# Altium project FPGA.PrjPcb
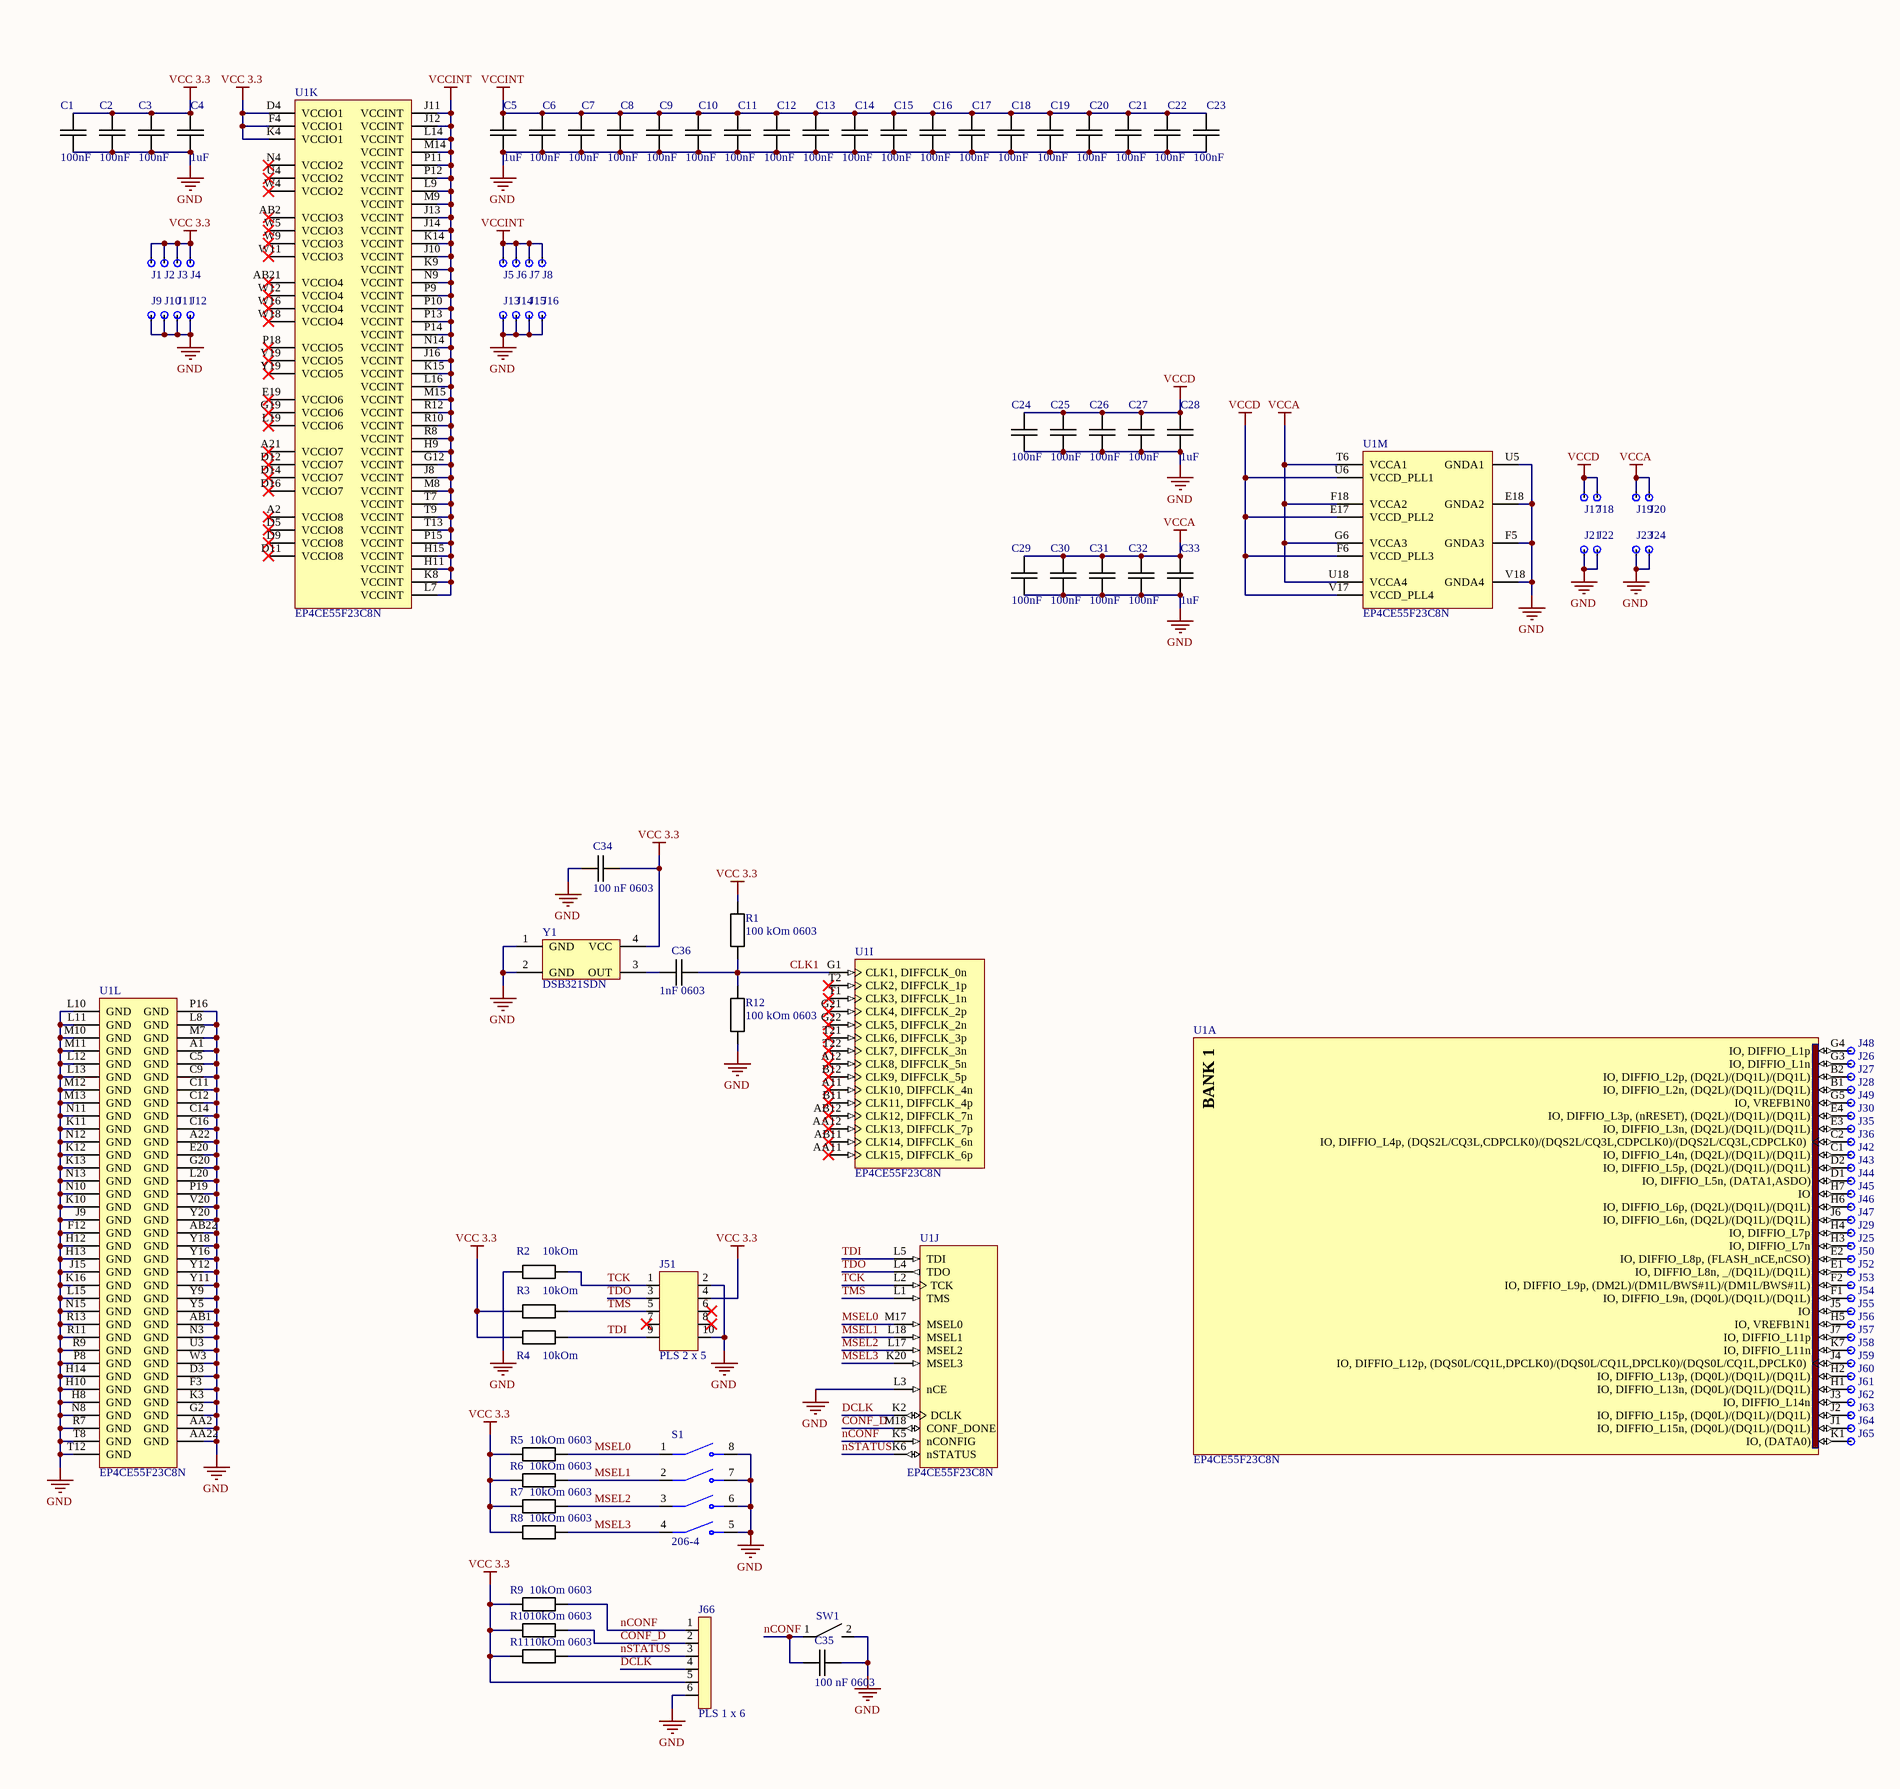
[diagram p0: Sheet1.SchDoc, left]
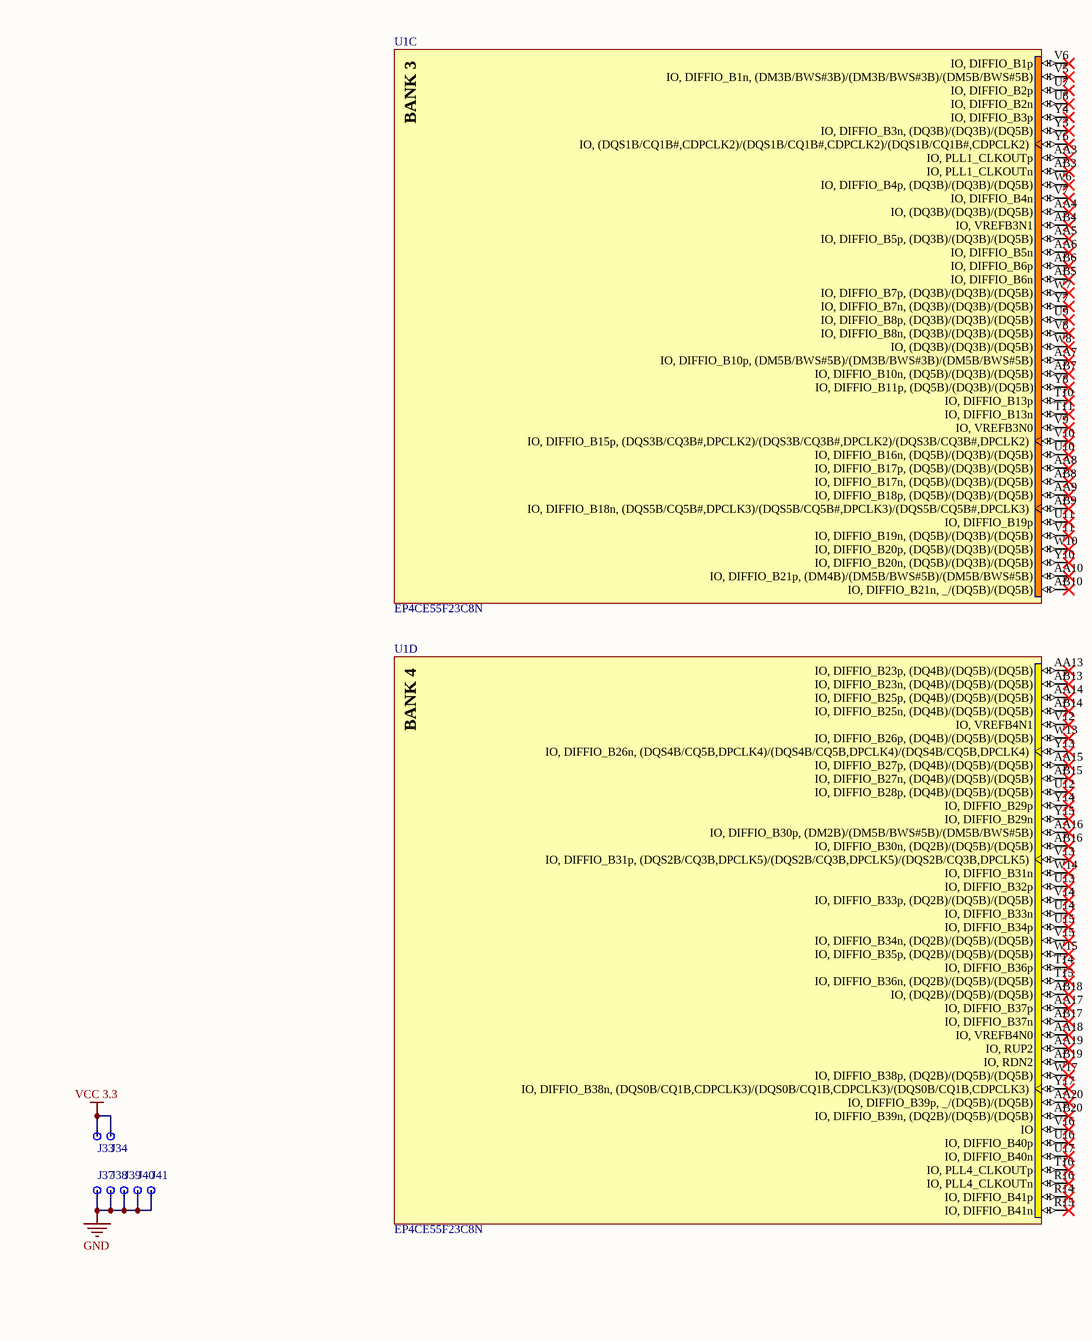
[diagram p1: Sheet1.SchDoc, middle]
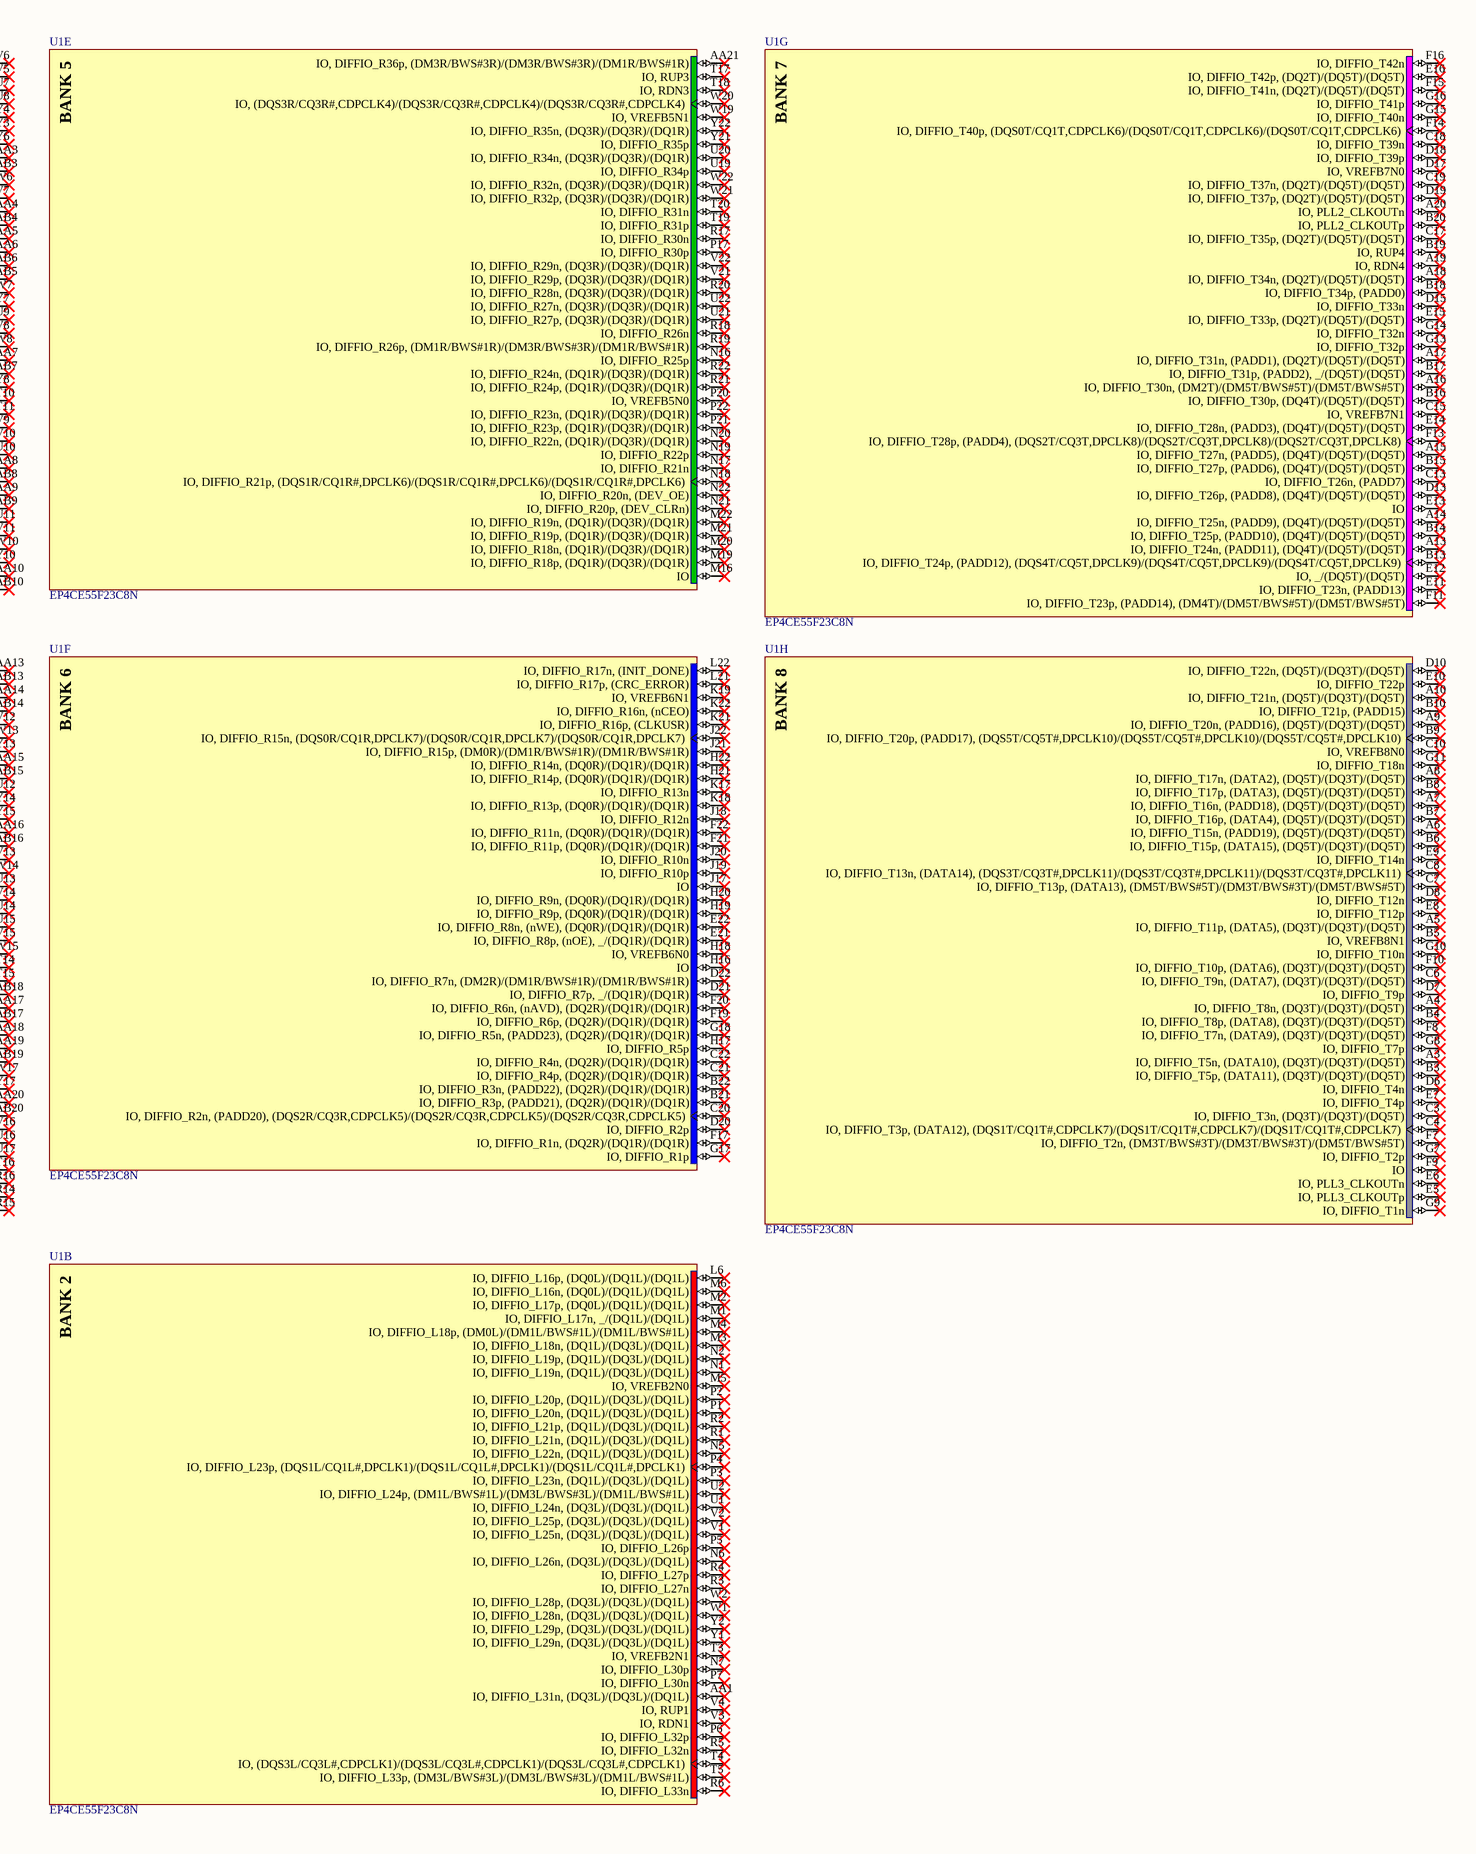
[diagram p2: Sheet1.SchDoc, right]
1 sheet, 116 parts. Net scope: global (net labels, ports and power ports of the same name join across sheets).
Board file: PCB_Main.PcbDoc

## Sheet Sheet1.SchDoc
size 889 x 381 mm; SheetNumber: 1; SheetTotal: 1

### Parts
C1  100nF  [CAPC1608X90]
C2  100nF  [CAPC1608X90]
C3  100nF  [CAPC1608X90]
C4  1uF  [CAPC1608X90]
C5  1uF  [CAPC1608X90]
C6  100nF  [CAPC1608X90]
C7  100nF  [CAPC1608X90]
C8  100nF  [CAPC1608X90]
C9  100nF  [CAPC1608X90]
C10  100nF  [CAPC1608X90]
C11  100nF  [CAPC1608X90]
C12  100nF  [CAPC1608X90]
C13  100nF  [CAPC1608X90]
C14  100nF  [CAPC1608X90]
C15  100nF  [CAPC1608X90]
C16  100nF  [CAPC1608X90]
C17  100nF  [CAPC1608X90]
C18  100nF  [CAPC1608X90]
C19  100nF  [CAPC1608X90]
C20  100nF  [CAPC1608X90]
C21  100nF  [CAPC1608X90]
C22  100nF  [CAPC1608X90]
C23  100nF  [CAPC1608X90]
C24  100nF  [CAPC1608X90]
C25  100nF  [CAPC1608X90]
C26  100nF  [CAPC1608X90]
C27  100nF  [CAPC1608X90]
C28  1uF  [CAPC1608X90]
C29  100nF  [CAPC1608X90]
C30  100nF  [CAPC1608X90]
C31  100nF  [CAPC1608X90]
C32  100nF  [CAPC1608X90]
C33  1uF  [CAPC1608X90]
C34  100 nF 0603  [CAPC1608X90]
C35  100 nF 0603  [CAPC1608X90]
C36  1nF 0603  [CAPC1608X90]
J1  Pin1  [Pin1]  (value not drawn)
J2  Pin1  [Pin1]  (value not drawn)
J3  Pin1  [Pin1]  (value not drawn)
J4  Pin1  [Pin1]  (value not drawn)
J5  Pin1  [Pin1]  (value not drawn)
J6  Pin1  [Pin1]  (value not drawn)
J7  Pin1  [Pin1]  (value not drawn)
J8  Pin1  [Pin1]  (value not drawn)
J9  Pin1  [Pin1]  (value not drawn)
J10  Pin1  [Pin1]  (value not drawn)
J11  Pin1  [Pin1]  (value not drawn)
J12  Pin1  [Pin1]  (value not drawn)
J13  Pin1  [Pin1]  (value not drawn)
J14  Pin1  [Pin1]  (value not drawn)
J15  Pin1  [Pin1]  (value not drawn)
J16  Pin1  [Pin1]  (value not drawn)
J17  Pin1  [Pin1]  (value not drawn)
J18  Pin1  [Pin1]  (value not drawn)
J19  Pin1  [Pin1]  (value not drawn)
J20  Pin1  [Pin1]  (value not drawn)
J21  Pin1  [Pin1]  (value not drawn)
J22  Pin1  [Pin1]  (value not drawn)
J23  Pin1  [Pin1]  (value not drawn)
J24  Pin1  [Pin1]  (value not drawn)
J25  Pin1  [Pin1]  (value not drawn)
J26  Pin1  [Pin1]  (value not drawn)
J27  Pin1  [Pin1]  (value not drawn)
J28  Pin1  [Pin1]  (value not drawn)
J29  Pin1  [Pin1]  (value not drawn)
J30  Pin1  [Pin1]  (value not drawn)
J33  Pin1  [Pin1]  (value not drawn)
J34  Pin1  [Pin1]  (value not drawn)
J35  Pin1  [Pin1]  (value not drawn)
J36  Pin1  [Pin1]  (value not drawn)
J37  Pin1  [Pin1]  (value not drawn)
J38  Pin1  [Pin1]  (value not drawn)
J39  Pin1  [Pin1]  (value not drawn)
J40  Pin1  [Pin1]  (value not drawn)
J41  Pin1  [Pin1]  (value not drawn)
J42  Pin1  [Pin1]  (value not drawn)
J43  Pin1  [Pin1]  (value not drawn)
J44  Pin1  [Pin1]  (value not drawn)
J45  Pin1  [Pin1]  (value not drawn)
J46  Pin1  [Pin1]  (value not drawn)
J47  Pin1  [Pin1]  (value not drawn)
J48  Pin1  [Pin1]  (value not drawn)
J49  Pin1  [Pin1]  (value not drawn)
J50  Pin1  [Pin1]  (value not drawn)
J51  PLS 2 x 5  [PLS 2x5 2.54]
J52  Pin1  [Pin1]  (value not drawn)
J53  Pin1  [Pin1]  (value not drawn)
J54  Pin1  [Pin1]  (value not drawn)
J55  Pin1  [Pin1]  (value not drawn)
J56  Pin1  [Pin1]  (value not drawn)
J57  Pin1  [Pin1]  (value not drawn)
J58  Pin1  [Pin1]  (value not drawn)
J59  Pin1  [Pin1]  (value not drawn)
J60  Pin1  [Pin1]  (value not drawn)
J61  Pin1  [Pin1]  (value not drawn)
J62  Pin1  [Pin1]  (value not drawn)
J63  Pin1  [Pin1]  (value not drawn)
J64  Pin1  [Pin1]  (value not drawn)
J65  Pin1  [Pin1]  (value not drawn)
J66  PLS 1 x 6  [PLS 1x6 2.54]
R1  100 kOm 0603  [RES 0603]
R2  10kOm  [RES 0603]
R3  10kOm  [RES 0603]
R4  10kOm  [RES 0603]
R5  10kOm 0603  [RES 0603]
R6  10kOm 0603  [RES 0603]
R7  10kOm 0603  [RES 0603]
R8  10kOm 0603  [RES 0603]
R9  10kOm 0603  [RES 0603]
R10  10kOm 0603  [RES 0603]
R11  10kOm 0603  [RES 0603]
R12  100 kOm 0603  [RES 0603]
S1  206-4  [SW_206-4]
SW1  (no value)  [SW_5-1437565-0]
U1  EP4CE55F23C8N  [FBGA484_A-240]  (parts A,B,C,D,E,F,G,H,I,J,K,L,M of 13)
Y1  DSB321SDN  [DSB321SDN]

### Nets
GND: C1.1 C2.1 C3.1 C4.1 C5.1 C6.1 C7.1 C8.1 C9.1 C10.1 C11.1 C12.1 C13.1 C14.1 C15.1 C16.1 C17.1 C18.1 C19.1 C20.1 C21.1 C22.1 C23.1 C24.1 C25.1 C26.1 C27.1 C28.1 C29.1 C30.1 C31.1 C32.1 C33.1 C34.1 C35.2 J9.1 J10.1 J11.1 J12.1 J13.1 J14.1 J15.1 J16.1 J21.1 J22.1 J23.1 J24.1 J37.1 J38.1 J39.1 J40.1 J41.1 J51.2 J51.10 J66.6 R2.1 R12.2 S1.5(NO4) S1.6(NO3) S1.7(NO2) S1.8(NO1) SW1.2 U1.A1(GND) U1.A22(GND) U1.AA2(GND) U1.AA22(GND) U1.AB1(GND) U1.AB22(GND) U1.C5(GND) U1.C9(GND) U1.C11(GND) U1.C12(GND) U1.C14(GND) U1.C16(GND) U1.D3(GND) U1.E18(GNDA2) U1.E20(GND) U1.F3(GND) U1.F5(GNDA3) U1.F12(GND) U1.G2(GND) U1.G20(GND) U1.H8(GND) U1.H10(GND) U1.H12(GND) U1.H13(GND) U1.H14(GND) U1.J9(GND) U1.J15(GND) U1.K3(GND) U1.K10(GND) U1.K11(GND) U1.K12(GND) U1.K13(GND) U1.K16(GND) U1.L3(nCE) U1.L8(GND) U1.L10(GND) U1.L11(GND) U1.L12(GND) U1.L13(GND) U1.L15(GND) U1.L20(GND) U1.M7(GND) U1.M10(GND) U1.M11(GND) U1.M12(GND) U1.M13(GND) U1.N3(GND) U1.N8(GND) U1.N10(GND) U1.N11(GND) U1.N12(GND) U1.N13(GND) U1.N15(GND) U1.P8(GND) U1.P16(GND) U1.P19(GND) U1.R7(GND) U1.R9(GND) U1.R11(GND) U1.R13(GND) U1.T8(GND) U1.T12(GND) U1.U3(GND) U1.U5(GNDA1) U1.V18(GNDA4) U1.V20(GND) U1.W3(GND) U1.Y5(GND) U1.Y9(GND) U1.Y11(GND) U1.Y12(GND) U1.Y16(GND) U1.Y18(GND) U1.Y20(GND) Y1.1(GND) Y1.2(GND)
VCC 3.3: C1.2 C2.2 C3.2 C4.2 C34.2 J1.1 J2.1 J3.1 J4.1 J33.1 J34.1 J51.4 J66.5 R1.2 R3.2 R4.2 R5.2 R6.2 R7.2 R8.2 R9.2 R10.2 R11.2 U1.D4(VCCIO1) U1.F4(VCCIO1) U1.K4(VCCIO1) Y1.4(VCC)
VCCA: C29.2 C30.2 C31.2 C32.2 C33.2 J19.1 J20.1 U1.F18(VCCA2) U1.G6(VCCA3) U1.T6(VCCA1) U1.U18(VCCA4)
VCCD: C24.2 C25.2 C26.2 C27.2 C28.2 J17.1 J18.1 U1.E17(VCCD_PLL2) U1.F6(VCCD_PLL3) U1.U6(VCCD_PLL1) U1.V17(VCCD_PLL4)
VCCINT: C5.2 C6.2 C7.2 C8.2 C9.2 C10.2 C11.2 C12.2 C13.2 C14.2 C15.2 C16.2 C17.2 C18.2 C19.2 C20.2 C21.2 C22.2 C23.2 J5.1 J6.1 J7.1 J8.1 U1.G12(VCCINT) U1.H9(VCCINT) U1.H11(VCCINT) U1.H15(VCCINT) U1.J8(VCCINT) U1.J10(VCCINT) U1.J11(VCCINT) U1.J12(VCCINT) U1.J13(VCCINT) U1.J14(VCCINT) U1.J16(VCCINT) U1.K8(VCCINT) U1.K9(VCCINT) U1.K14(VCCINT) U1.K15(VCCINT) U1.L7(VCCINT) U1.L9(VCCINT) U1.L14(VCCINT) U1.L16(VCCINT) U1.M8(VCCINT) U1.M9(VCCINT) U1.M14(VCCINT) U1.M15(VCCINT) U1.N9(VCCINT) U1.N14(VCCINT) U1.P9(VCCINT) U1.P10(VCCINT) U1.P11(VCCINT) U1.P12(VCCINT) U1.P13(VCCINT) U1.P14(VCCINT) U1.P15(VCCINT) U1.R8(VCCINT) U1.R10(VCCINT) U1.R12(VCCINT) U1.T7(VCCINT) U1.T9(VCCINT) U1.T13(VCCINT)
CLK1: C36.2 R1.1 R12.1 U1.G1(CLK1,_DIFFCLK_0n)
CONF_D: J66.2 R10.1 U1.M18(CONF_DONE)
DCLK: J66.4 U1.K2(DCLK)
MSEL0: R5.1 S1.1(COM1) U1.M17(MSEL0)
MSEL1: R6.1 S1.2(COM2) U1.L18(MSEL1)
MSEL2: R7.1 S1.3(COM3) U1.L17(MSEL2)
MSEL3: R8.1 S1.4(COM4) U1.K20(MSEL3)
nCONF: C35.1 J66.1 R9.1 SW1.1 U1.K5(nCONFIG)
nSTATUS: J66.3 R11.1 U1.K6(nSTATUS)
TCK: J51.1 R2.2 U1.L2(TCK)
TDI: J51.9 R4.1 U1.L5(TDI)
TDO: J51.3 U1.L4(TDO)
TMS: J51.5 R3.1 U1.L1(TMS)
NetC36_1: C36.1 Y1.3(OUT)
NetJ25_1: J25.1 U1.H3(IO,_DIFFIO_L7n)
NetJ26_1: J26.1 U1.G3(IO,_DIFFIO_L1n)
NetJ27_1: J27.1 U1.B2(IO,_DIFFIO_L2p,_(DQ2L)/(DQ1L)/(DQ1L))
NetJ28_1: J28.1 U1.B1(IO,_DIFFIO_L2n,_(DQ2L)/(DQ1L)/(DQ1L))
NetJ29_1: J29.1 U1.H4(IO,_DIFFIO_L7p)
NetJ30_1: J30.1 U1.E4(IO,_DIFFIO_L3p,_(nRESET),_(DQ2L)/(DQ1L)/(DQ1L))
NetJ35_1: J35.1 U1.E3(IO,_DIFFIO_L3n,_(DQ2L)/(DQ1L)/(DQ1L))
NetJ36_1: J36.1 U1.C2(IO,_DIFFIO_L4p,_(DQS2L/CQ3L,CDPCLK0)/(DQS2L/CQ3L,CDPCLK0)/(DQS2L/CQ3L,CDPCLK0))
NetJ42_1: J42.1 U1.C1(IO,_DIFFIO_L4n,_(DQ2L)/(DQ1L)/(DQ1L))
NetJ43_1: J43.1 U1.D2(IO,_DIFFIO_L5p,_(DQ2L)/(DQ1L)/(DQ1L))
NetJ44_1: J44.1 U1.D1(IO,_DIFFIO_L5n,_(DATA1,ASDO))
NetJ45_1: J45.1 U1.H7(IO)
NetJ46_1: J46.1 U1.H6(IO,_DIFFIO_L6p,_(DQ2L)/(DQ1L)/(DQ1L))
NetJ47_1: J47.1 U1.J6(IO,_DIFFIO_L6n,_(DQ2L)/(DQ1L)/(DQ1L))
NetJ48_1: J48.1 U1.G4(IO,_DIFFIO_L1p)
NetJ49_1: J49.1 U1.G5(IO,_VREFB1N0)
NetJ50_1: J50.1 U1.E2(IO,_DIFFIO_L8p,_(FLASH_nCE,nCSO))
NetJ52_1: J52.1 U1.E1(IO,_DIFFIO_L8n,__/(DQ1L)/(DQ1L))
NetJ53_1: J53.1 U1.F2(IO,_DIFFIO_L9p,_(DM2L)/(DM1L/BWS#1L)/(DM1L/BWS#1L))
NetJ54_1: J54.1 U1.F1(IO,_DIFFIO_L9n,_(DQ0L)/(DQ1L)/(DQ1L))
NetJ55_1: J55.1 U1.J5(IO)
NetJ56_1: J56.1 U1.H5(IO,_VREFB1N1)
NetJ57_1: J57.1 U1.J7(IO,_DIFFIO_L11p)
NetJ58_1: J58.1 U1.K7(IO,_DIFFIO_L11n)
NetJ59_1: J59.1 U1.J4(IO,_DIFFIO_L12p,_(DQS0L/CQ1L,DPCLK0)/(DQS0L/CQ1L,DPCLK0)/(DQS0L/CQ1L,DPCLK0))
NetJ60_1: J60.1 U1.H2(IO,_DIFFIO_L13p,_(DQ0L)/(DQ1L)/(DQ1L))
NetJ61_1: J61.1 U1.H1(IO,_DIFFIO_L13n,_(DQ0L)/(DQ1L)/(DQ1L))
NetJ62_1: J62.1 U1.J3(IO,_DIFFIO_L14n)
NetJ63_1: J63.1 U1.J2(IO,_DIFFIO_L15p,_(DQ0L)/(DQ1L)/(DQ1L))
NetJ64_1: J64.1 U1.J1(IO,_DIFFIO_L15n,_(DQ0L)/(DQ1L)/(DQ1L))
NetJ65_1: J65.1 U1.K1(IO,_(DATA0))

Not connected (* = marked no-connect by the designer): J51 6* 7* 8*; U1 A2(VCCIO8)* A3(IO,_DIFFIO_T5n,_(DATA10),_(DQ3T)/(DQ3T)/(DQ5T))* A4(IO,_DIFFIO_T8n,_(DQ3T)/(DQ3T)/(DQ5T))* A5(IO,_DIFFIO_T11p,_(DATA5),_(DQ3T)/(DQ3T)/(DQ5T))* A6(IO,_DIFFIO_T15n,_(PADD19),_(DQ5T)/(DQ3T)/(DQ5T))* A7(IO,_DIFFIO_T16n,_(PADD18),_(DQ5T)/(DQ3T)/(DQ5T))* A8(IO,_DIFFIO_T17n,_(DATA2),_(DQ5T)/(DQ3T)/(DQ5T))* A9(IO,_DIFFIO_T20n,_(PADD16),_(DQ5T)/(DQ3T)/(DQ5T))* A10(IO,_DIFFIO_T21n,_(DQ5T)/(DQ3T)/(DQ5T))* A11(CLK10,_DIFFCLK_4n)* A12(CLK8,_DIFFCLK_5n)* A13(IO,_DIFFIO_T24n,_(PADD11),_(DQ4T)/(DQ5T)/(DQ5T))* A14(IO,_DIFFIO_T25n,_(PADD9),_(DQ4T)/(DQ5T)/(DQ5T))* A15(IO,_DIFFIO_T27n,_(PADD5),_(DQ4T)/(DQ5T)/(DQ5T))* A16(IO,_DIFFIO_T30n,_(DM2T)/(DM5T/BWS#5T)/(DM5T/BWS#5T))* A17(IO,_DIFFIO_T31n,_(PADD1),_(DQ2T)/(DQ5T)/(DQ5T))* A18(IO,_DIFFIO_T34n,_(DQ2T)/(DQ5T)/(DQ5T))* A19(IO,_RDN4)* A20(IO,_PLL2_CLKOUTn)* A21(VCCIO7)* AA1(IO,_DIFFIO_L31n,_(DQ3L)/(DQ3L)/(DQ1L))* AA3(IO,_PLL1_CLKOUTp)* AA4(IO,_(DQ3B)/(DQ3B)/(DQ5B))* AA5(IO,_DIFFIO_B5p,_(DQ3B)/(DQ3B)/(DQ5B))* AA6(IO,_DIFFIO_B5n)* AA7(IO,_DIFFIO_B10p,_(DM5B/BWS#5B)/(DM3B/BWS#3B)/(DM5B/BWS#5B))* AA8(IO,_DIFFIO_B17p,_(DQ5B)/(DQ3B)/(DQ5B))* AA9(IO,_DIFFIO_B18p,_(DQ5B)/(DQ3B)/(DQ5B))* AA10(IO,_DIFFIO_B21p,_(DM4B)/(DM5B/BWS#5B)/(DM5B/BWS#5B))* AA11(CLK15,_DIFFCLK_6p)* AA12(CLK13,_DIFFCLK_7p)* AA13(IO,_DIFFIO_B23p,_(DQ4B)/(DQ5B)/(DQ5B))* AA14(IO,_DIFFIO_B25p,_(DQ4B)/(DQ5B)/(DQ5B))* AA15(IO,_DIFFIO_B27p,_(DQ4B)/(DQ5B)/(DQ5B))* AA16(IO,_DIFFIO_B30p,_(DM2B)/(DM5B/BWS#5B)/(DM5B/BWS#5B))* AA17(IO,_DIFFIO_B37p)* AA18(IO,_VREFB4N0)* AA19(IO,_RUP2)* AA20(IO,_DIFFIO_B39p,__/(DQ5B)/(DQ5B))* AA21(IO,_DIFFIO_R36p,_(DM3R/BWS#3R)/(DM3R/BWS#3R)/(DM1R/BWS#1R))* AB2(VCCIO3)* AB3(IO,_PLL1_CLKOUTn)* AB4(IO,_VREFB3N1)* AB5(IO,_DIFFIO_B6n)* AB6(IO,_DIFFIO_B6p)* AB7(IO,_DIFFIO_B10n,_(DQ5B)/(DQ3B)/(DQ5B))* AB8(IO,_DIFFIO_B17n,_(DQ5B)/(DQ3B)/(DQ5B))* AB9(IO,_DIFFIO_B18n,_(DQS5B/CQ5B#,DPCLK3)/(DQS5B/CQ5B#,DPCLK3)/(DQS5B/CQ5B#,DPCLK3))* AB10(IO,_DIFFIO_B21n,__/(DQ5B)/(DQ5B))* AB11(CLK14,_DIFFCLK_6n)* AB12(CLK12,_DIFFCLK_7n)* AB13(IO,_DIFFIO_B23n,_(DQ4B)/(DQ5B)/(DQ5B))* AB14(IO,_DIFFIO_B25n,_(DQ4B)/(DQ5B)/(DQ5B))* AB15(IO,_DIFFIO_B27n,_(DQ4B)/(DQ5B)/(DQ5B))* AB16(IO,_DIFFIO_B30n,_(DQ2B)/(DQ5B)/(DQ5B))* AB17(IO,_DIFFIO_B37n)* AB18(IO,_(DQ2B)/(DQ5B)/(DQ5B))* AB19(IO,_RDN2)* AB20(IO,_DIFFIO_B39n,_(DQ2B)/(DQ5B)/(DQ5B))* AB21(VCCIO4)* B3(IO,_DIFFIO_T5p,_(DATA11),_(DQ3T)/(DQ3T)/(DQ5T))* B4(IO,_DIFFIO_T8p,_(DATA8),_(DQ3T)/(DQ3T)/(DQ5T))* B5(IO,_VREFB8N1)* B6(IO,_DIFFIO_T15p,_(DATA15),_(DQ5T)/(DQ3T)/(DQ5T))* B7(IO,_DIFFIO_T16p,_(DATA4),_(DQ5T)/(DQ3T)/(DQ5T))* B8(IO,_DIFFIO_T17p,_(DATA3),_(DQ5T)/(DQ3T)/(DQ5T))* B9(IO,_DIFFIO_T20p,_(PADD17),_(DQS5T/CQ5T#,DPCLK10)/(DQS5T/CQ5T#,DPCLK10)/(DQS5T/CQ5T#,DPCLK10))* B10(IO,_DIFFIO_T21p,_(PADD15))* B11(CLK11,_DIFFCLK_4p)* B12(CLK9,_DIFFCLK_5p)* B13(IO,_DIFFIO_T24p,_(PADD12),_(DQS4T/CQ5T,DPCLK9)/(DQS4T/CQ5T,DPCLK9)/(DQS4T/CQ5T,DPCLK9))* B14(IO,_DIFFIO_T25p,_(PADD10),_(DQ4T)/(DQ5T)/(DQ5T))* B15(IO,_DIFFIO_T27p,_(PADD6),_(DQ4T)/(DQ5T)/(DQ5T))* B16(IO,_DIFFIO_T30p,_(DQ4T)/(DQ5T)/(DQ5T))* B17(IO,_DIFFIO_T31p,_(PADD2),__/(DQ5T)/(DQ5T))* B18(IO,_DIFFIO_T34p,_(PADD0))* B19(IO,_RUP4)* B20(IO,_PLL2_CLKOUTp)* B21(IO,_DIFFIO_R3p,_(PADD21),_(DQ2R)/(DQ1R)/(DQ1R))* B22(IO,_DIFFIO_R3n,_(PADD22),_(DQ2R)/(DQ1R)/(DQ1R))* C3(IO,_DIFFIO_T3n,_(DQ3T)/(DQ3T)/(DQ5T))* C4(IO,_DIFFIO_T3p,_(DATA12),_(DQS1T/CQ1T#,CDPCLK7)/(DQS1T/CQ1T#,CDPCLK7)/(DQS1T/CQ1T#,CDPCLK7))* C6(IO,_DIFFIO_T9n,_(DATA7),_(DQ3T)/(DQ3T)/(DQ5T))* C7(IO,_DIFFIO_T13p,_(DATA13),_(DM5T/BWS#5T)/(DM3T/BWS#3T)/(DM5T/BWS#5T))* C8(IO,_DIFFIO_T13n,_(DATA14),_(DQS3T/CQ3T#,DPCLK11)/(DQS3T/CQ3T#,DPCLK11)/(DQS3T/CQ3T#,DPCLK11))* C10(IO,_VREFB8N0)* C13(IO,_DIFFIO_T26n,_(PADD7))* C15(IO,_VREFB7N1)* C17(IO,_DIFFIO_T35p,_(DQ2T)/(DQ5T)/(DQ5T))* C18(IO,_DIFFIO_T39n)* C19(IO,_DIFFIO_T37n,_(DQ2T)/(DQ5T)/(DQ5T))* C20(IO,_DIFFIO_R2n,_(PADD20),_(DQS2R/CQ3R,CDPCLK5)/(DQS2R/CQ3R,CDPCLK5)/(DQS2R/CQ3R,CDPCLK5))* C21(IO,_DIFFIO_R4p,_(DQ2R)/(DQ1R)/(DQ1R))* C22(IO,_DIFFIO_R4n,_(DQ2R)/(DQ1R)/(DQ1R))* D5(VCCIO8)* D6(IO,_DIFFIO_T4n)* D7(IO,_DIFFIO_T9p)* D8(IO,_DIFFIO_T12n)* D9(VCCIO8)* D10(IO,_DIFFIO_T22n,_(DQ5T)/(DQ3T)/(DQ5T))* D11(VCCIO8)* D12(VCCIO7)* D13(IO,_DIFFIO_T26p,_(PADD8),_(DQ4T)/(DQ5T)/(DQ5T))* D14(VCCIO7)* D15(IO,_DIFFIO_T33n)* D16(VCCIO7)* D17(IO,_VREFB7N0)* D18(IO,_DIFFIO_T39p)* D19(IO,_DIFFIO_T37p,_(DQ2T)/(DQ5T)/(DQ5T))* D20(IO,_DIFFIO_R2p)* D21(IO,_DIFFIO_R7p,__/(DQ1R)/(DQ1R))* D22(IO,_DIFFIO_R7n,_(DM2R)/(DM1R/BWS#1R)/(DM1R/BWS#1R))* E5(IO,_PLL3_CLKOUTp)* E6(IO,_PLL3_CLKOUTn)* E7(IO,_DIFFIO_T4p)* E8(IO,_DIFFIO_T12p)* E9(IO,_DIFFIO_T14n)* E10(IO,_DIFFIO_T22p)* E11(IO,_DIFFIO_T23n,_(PADD13))* E12(IO,__/(DQ5T)/(DQ5T))* E13(IO)* E14(IO,_DIFFIO_T28n,_(PADD3),_(DQ4T)/(DQ5T)/(DQ5T))* E15(IO,_DIFFIO_T33p,_(DQ2T)/(DQ5T)/(DQ5T))* E16(IO,_DIFFIO_T42p,_(DQ2T)/(DQ5T)/(DQ5T))* E19(VCCIO6)* E21(IO,_DIFFIO_R8p,_(nOE),__/(DQ1R)/(DQ1R))* E22(IO,_DIFFIO_R8n,_(nWE),_(DQ0R)/(DQ1R)/(DQ1R))* F7(IO,_DIFFIO_T2n,_(DM3T/BWS#3T)/(DM3T/BWS#3T)/(DM5T/BWS#5T))* F8(IO,_DIFFIO_T7n,_(DATA9),_(DQ3T)/(DQ3T)/(DQ5T))* F9(IO)* F10(IO,_DIFFIO_T10p,_(DATA6),_(DQ3T)/(DQ3T)/(DQ5T))* F11(IO,_DIFFIO_T23p,_(PADD14),_(DM4T)/(DM5T/BWS#5T)/(DM5T/BWS#5T))* F13(IO,_DIFFIO_T28p,_(PADD4),_(DQS2T/CQ3T,DPCLK8)/(DQS2T/CQ3T,DPCLK8)/(DQS2T/CQ3T,DPCLK8))* F14(IO,_DIFFIO_T40p,_(DQS0T/CQ1T,CDPCLK6)/(DQS0T/CQ1T,CDPCLK6)/(DQS0T/CQ1T,CDPCLK6))* F15(IO,_DIFFIO_T41n,_(DQ2T)/(DQ5T)/(DQ5T))* F16(IO,_DIFFIO_T42n)* F17(IO,_DIFFIO_R1n,_(DQ2R)/(DQ1R)/(DQ1R))* F19(IO,_DIFFIO_R6p,_(DQ2R)/(DQ1R)/(DQ1R))* F20(IO,_DIFFIO_R6n,_(nAVD),_(DQ2R)/(DQ1R)/(DQ1R))* F21(IO,_DIFFIO_R11p,_(DQ0R)/(DQ1R)/(DQ1R))* F22(IO,_DIFFIO_R11n,_(DQ0R)/(DQ1R)/(DQ1R))* G7(IO,_DIFFIO_T2p)* G8(IO,_DIFFIO_T7p)* G9(IO,_DIFFIO_T1n)* G10(IO,_DIFFIO_T10n)* G11(IO,_DIFFIO_T18n)* G13(IO,_DIFFIO_T32p)* G14(IO,_DIFFIO_T32n)* G15(IO,_DIFFIO_T40n)* G16(IO,_DIFFIO_T41p)* G17(IO,_DIFFIO_R1p)* G18(IO,_DIFFIO_R5n,_(PADD23),_(DQ2R)/(DQ1R)/(DQ1R))* G19(VCCIO6)* G21(CLK4,_DIFFCLK_2p)* G22(CLK5,_DIFFCLK_2n)* H16(IO)* H17(IO,_DIFFIO_R5p)* H18(IO,_VREFB6N0)* H19(IO,_DIFFIO_R9p,_(DQ0R)/(DQ1R)/(DQ1R))* H20(IO,_DIFFIO_R9n,_(DQ0R)/(DQ1R)/(DQ1R))* H21(IO,_DIFFIO_R14p,_(DQ0R)/(DQ1R)/(DQ1R))* H22(IO,_DIFFIO_R14n,_(DQ0R)/(DQ1R)/(DQ1R))* J17(IO)* J18(IO,_DIFFIO_R12n)* J19(IO,_DIFFIO_R10p)* J20(IO,_DIFFIO_R10n)* J21(IO,_DIFFIO_R15p,_(DM0R)/(DM1R/BWS#1R)/(DM1R/BWS#1R))* J22(IO,_DIFFIO_R15n,_(DQS0R/CQ1R,DPCLK7)/(DQS0R/CQ1R,DPCLK7)/(DQS0R/CQ1R,DPCLK7))* K17(IO,_DIFFIO_R13n)* K18(IO,_DIFFIO_R13p,_(DQ0R)/(DQ1R)/(DQ1R))* K19(IO,_VREFB6N1)* K21(IO,_DIFFIO_R16p,_(CLKUSR))* K22(IO,_DIFFIO_R16n,_(nCEO))* L6(IO,_DIFFIO_L16p,_(DQ0L)/(DQ1L)/(DQ1L))* L19(VCCIO6)* L21(IO,_DIFFIO_R17p,_(CRC_ERROR))* L22(IO,_DIFFIO_R17n,_(INIT_DONE))* M1(IO,_DIFFIO_L17n,__/(DQ1L)/(DQ1L))* M2(IO,_DIFFIO_L17p,_(DQ0L)/(DQ1L)/(DQ1L))* M3(IO,_DIFFIO_L18n,_(DQ1L)/(DQ3L)/(DQ1L))* M4(IO,_DIFFIO_L18p,_(DM0L)/(DM1L/BWS#1L)/(DM1L/BWS#1L))* M5(IO,_VREFB2N0)* M6(IO,_DIFFIO_L16n,_(DQ0L)/(DQ1L)/(DQ1L))* M16(IO)* M19(IO,_DIFFIO_R18p,_(DQ1R)/(DQ3R)/(DQ1R))* M20(IO,_DIFFIO_R18n,_(DQ1R)/(DQ3R)/(DQ1R))* M21(IO,_DIFFIO_R19p,_(DQ1R)/(DQ3R)/(DQ1R))* M22(IO,_DIFFIO_R19n,_(DQ1R)/(DQ3R)/(DQ1R))* N1(IO,_DIFFIO_L19n,_(DQ1L)/(DQ3L)/(DQ1L))* N2(IO,_DIFFIO_L19p,_(DQ1L)/(DQ3L)/(DQ1L))* N4(VCCIO2)* N5(IO,_DIFFIO_L22n,_(DQ1L)/(DQ3L)/(DQ1L))* N6(IO,_DIFFIO_L26n,_(DQ3L)/(DQ3L)/(DQ1L))* N7(IO,_DIFFIO_L30p)* N16(IO,_DIFFIO_R25p)* N17(IO,_DIFFIO_R21n)* N18(IO,_DIFFIO_R21p,_(DQS1R/CQ1R#,DPCLK6)/(DQS1R/CQ1R#,DPCLK6)/(DQS1R/CQ1R#,DPCLK6))* N19(IO,_DIFFIO_R22p)* N20(IO,_DIFFIO_R22n,_(DQ1R)/(DQ3R)/(DQ1R))* N21(IO,_DIFFIO_R20p,_(DEV_CLRn))* N22(IO,_DIFFIO_R20n,_(DEV_OE))* P1(IO,_DIFFIO_L20n,_(DQ1L)/(DQ3L)/(DQ1L))* P2(IO,_DIFFIO_L20p,_(DQ1L)/(DQ3L)/(DQ1L))* P3(IO,_DIFFIO_L23n,_(DQ1L)/(DQ3L)/(DQ1L))* P4(IO,_DIFFIO_L23p,_(DQS1L/CQ1L#,DPCLK1)/(DQS1L/CQ1L#,DPCLK1)/(DQS1L/CQ1L#,DPCLK1))* P5(IO,_DIFFIO_L26p)* P6(IO,_DIFFIO_L32p)* P7(IO,_DIFFIO_L30n)* P17(IO,_DIFFIO_R30p)* P18(VCCIO5)* P20(IO,_VREFB5N0)* P21(IO,_DIFFIO_R23p,_(DQ1R)/(DQ3R)/(DQ1R))* P22(IO,_DIFFIO_R23n,_(DQ1R)/(DQ3R)/(DQ1R))* R1(IO,_DIFFIO_L21n,_(DQ1L)/(DQ3L)/(DQ1L))* R2(IO,_DIFFIO_L21p,_(DQ1L)/(DQ3L)/(DQ1L))* R3(IO,_DIFFIO_L27n)* R4(IO,_DIFFIO_L27p)* R5(IO,_DIFFIO_L32n)* R6(IO,_DIFFIO_L33n)* R14(IO,_DIFFIO_B41p)* R15(IO,_DIFFIO_B41n)* R16(IO,_PLL4_CLKOUTn)* R17(IO,_DIFFIO_R30n)* R18(IO,_DIFFIO_R26n)* R19(IO,_DIFFIO_R26p,_(DM1R/BWS#1R)/(DM3R/BWS#3R)/(DM1R/BWS#1R))* R20(IO,_DIFFIO_R28n,_(DQ3R)/(DQ3R)/(DQ1R))* R21(IO,_DIFFIO_R24p,_(DQ1R)/(DQ3R)/(DQ1R))* R22(IO,_DIFFIO_R24n,_(DQ1R)/(DQ3R)/(DQ1R))* T1(CLK3,_DIFFCLK_1n)* T2(CLK2,_DIFFCLK_1p)* T3(IO,_VREFB2N1)* T4(IO,_(DQS3L/CQ3L#,CDPCLK1)/(DQS3L/CQ3L#,CDPCLK1)/(DQS3L/CQ3L#,CDPCLK1))* T5(IO,_DIFFIO_L33p,_(DM3L/BWS#3L)/(DM3L/BWS#3L)/(DM1L/BWS#1L))* T10(IO,_DIFFIO_B13p)* T11(IO,_DIFFIO_B13n)* T14(IO,_DIFFIO_B36p)* T15(IO,_DIFFIO_B36n,_(DQ2B)/(DQ5B)/(DQ5B))* T16(IO,_PLL4_CLKOUTp)* T17(IO,_RUP3)* T18(IO,_RDN3)* T19(IO,_DIFFIO_R31p)* T20(IO,_DIFFIO_R31n)* T21(CLK6,_DIFFCLK_3p)* T22(CLK7,_DIFFCLK_3n)* U1(IO,_DIFFIO_L24n,_(DQ3L)/(DQ3L)/(DQ1L))* U2(IO,_DIFFIO_L24p,_(DM1L/BWS#1L)/(DM3L/BWS#3L)/(DM1L/BWS#1L))* U4(VCCIO2)* U7(IO,_DIFFIO_B2p)* U8(IO,_DIFFIO_B2n)* U9(IO,_DIFFIO_B8p,_(DQ3B)/(DQ3B)/(DQ5B))* U10(IO,_DIFFIO_B16n,_(DQ5B)/(DQ3B)/(DQ5B))* U11(IO,_DIFFIO_B19p)* U12(IO,_DIFFIO_B28p,_(DQ4B)/(DQ5B)/(DQ5B))* U13(IO,_DIFFIO_B32p)* U14(IO,_DIFFIO_B33n)* U15(IO,_DIFFIO_B34p)* U16(IO,_DIFFIO_B40p)* U17(IO,_DIFFIO_B40n)* U19(IO,_DIFFIO_R34p)* U20(IO,_DIFFIO_R34n,_(DQ3R)/(DQ3R)/(DQ1R))* U21(IO,_DIFFIO_R27p,_(DQ3R)/(DQ3R)/(DQ1R))* U22(IO,_DIFFIO_R27n,_(DQ3R)/(DQ3R)/(DQ1R))* V1(IO,_DIFFIO_L25n,_(DQ3L)/(DQ3L)/(DQ1L))* V2(IO,_DIFFIO_L25p,_(DQ3L)/(DQ3L)/(DQ1L))* V3(IO,_RDN1)* V4(IO,_RUP1)* V5(IO,_DIFFIO_B1n,_(DM3B/BWS#3B)/(DM3B/BWS#3B)/(DM5B/BWS#5B))* V6(IO,_DIFFIO_B1p)* V7(IO,_DIFFIO_B4n)* V8(IO,_DIFFIO_B8n,_(DQ3B)/(DQ3B)/(DQ5B))* V9(IO,_VREFB3N0)* V10(IO,_DIFFIO_B15p,_(DQS3B/CQ3B#,DPCLK2)/(DQS3B/CQ3B#,DPCLK2)/(DQS3B/CQ3B#,DPCLK2))* V11(IO,_DIFFIO_B19n,_(DQ5B)/(DQ3B)/(DQ5B))* V12(IO,_VREFB4N1)* V13(IO,_DIFFIO_B31p,_(DQS2B/CQ3B,DPCLK5)/(DQS2B/CQ3B,DPCLK5)/(DQS2B/CQ3B,DPCLK5))* V14(IO,_DIFFIO_B33p,_(DQ2B)/(DQ5B)/(DQ5B))* V15(IO,_DIFFIO_B34n,_(DQ2B)/(DQ5B)/(DQ5B))* V16(IO)* V19(VCCIO5)* V21(IO,_DIFFIO_R29p,_(DQ3R)/(DQ3R)/(DQ1R))* V22(IO,_DIFFIO_R29n,_(DQ3R)/(DQ3R)/(DQ1R))* W1(IO,_DIFFIO_L28n,_(DQ3L)/(DQ3L)/(DQ1L))* W2(IO,_DIFFIO_L28p,_(DQ3L)/(DQ3L)/(DQ1L))* W4(VCCIO2)* W5(VCCIO3)* W6(IO,_DIFFIO_B4p,_(DQ3B)/(DQ3B)/(DQ5B))* W7(IO,_DIFFIO_B7p,_(DQ3B)/(DQ3B)/(DQ5B))* W8(IO,_(DQ3B)/(DQ3B)/(DQ5B))* W9(VCCIO3)* W10(IO,_DIFFIO_B20p,_(DQ5B)/(DQ3B)/(DQ5B))* W11(VCCIO3)* W12(VCCIO4)* W13(IO,_DIFFIO_B26p,_(DQ4B)/(DQ5B)/(DQ5B))* W14(IO,_DIFFIO_B31n)* W15(IO,_DIFFIO_B35p,_(DQ2B)/(DQ5B)/(DQ5B))* W16(VCCIO4)* W17(IO,_DIFFIO_B38p,_(DQ2B)/(DQ5B)/(DQ5B))* W18(VCCIO4)* W19(IO,_VREFB5N1)* W20(IO,_(DQS3R/CQ3R#,CDPCLK4)/(DQS3R/CQ3R#,CDPCLK4)/(DQS3R/CQ3R#,CDPCLK4))* W21(IO,_DIFFIO_R32p,_(DQ3R)/(DQ3R)/(DQ1R))* W22(IO,_DIFFIO_R32n,_(DQ3R)/(DQ3R)/(DQ1R))* Y1(IO,_DIFFIO_L29n,_(DQ3L)/(DQ3L)/(DQ1L))* Y2(IO,_DIFFIO_L29p,_(DQ3L)/(DQ3L)/(DQ1L))* Y3(IO,_DIFFIO_B3n,_(DQ3B)/(DQ3B)/(DQ5B))* Y4(IO,_DIFFIO_B3p)* Y6(IO,_(DQS1B/CQ1B#,CDPCLK2)/(DQS1B/CQ1B#,CDPCLK2)/(DQS1B/CQ1B#,CDPCLK2))* Y7(IO,_DIFFIO_B7n,_(DQ3B)/(DQ3B)/(DQ5B))* Y8(IO,_DIFFIO_B11p,_(DQ5B)/(DQ3B)/(DQ5B))* Y10(IO,_DIFFIO_B20n,_(DQ5B)/(DQ3B)/(DQ5B))* Y13(IO,_DIFFIO_B26n,_(DQS4B/CQ5B,DPCLK4)/(DQS4B/CQ5B,DPCLK4)/(DQS4B/CQ5B,DPCLK4))* Y14(IO,_DIFFIO_B29p)* Y15(IO,_DIFFIO_B29n)* Y17(IO,_DIFFIO_B38n,_(DQS0B/CQ1B,CDPCLK3)/(DQS0B/CQ1B,CDPCLK3)/(DQS0B/CQ1B,CDPCLK3))* Y19(VCCIO5)* Y21(IO,_DIFFIO_R35p)* Y22(IO,_DIFFIO_R35n,_(DQ3R)/(DQ3R)/(DQ1R))*

### Notes on the sheet
- (in symbol CMP-0038-00161-1, part A) BANK 1
- (in symbol CMP-0038-00161-1, part B) BANK 2
- (in symbol CMP-0038-00161-1, part C) BANK 3
- (in symbol CMP-0038-00161-1, part D) BANK 4
- (in symbol CMP-0038-00161-1, part E) BANK 5
- (in symbol CMP-0038-00161-1, part F) BANK 6
- (in symbol CMP-0038-00161-1, part G) BANK 7
- (in symbol CMP-0038-00161-1, part H) BANK 8

### Library data of the parts
C1-C3 C6-C27 C29-C32 = 100 nF 0603
C4 C5 C28 C33 = 1uF 0603
R2-R4 = 10kOm 0603
S1 = 206-4: MF: {'manufacturer': u'CTS Components'}; Package: None; Price: None; Value: *; MP: 206-4; Availability: Unavailable
SW1 = 5-1437565-0: Alcoswitch, Tactile switch,SMT,SPST,raised actuator | TE Connectivity FSM6JSMATR; SnapEDA_Link: https://www.snapeda.com/parts/FSM6JSMATR/TE+Connectivity+ALCOSWITCH+Switches/view-part/?ref=snap; Package: None; Value: *; MF: TE Connectivity; MP: FSM6JSMATR; Check_prices: https://www.snapeda.com/parts/FSM6JSMATR/TE+Connectivity+ALCOSWITCH+Switches/view-part/?ref=eda
U1 = CMP-0038-00161-1: Cyclone IV Family FPGA, 1.2V Core, 324 I/O Pins, 4 PLLs, 484-Pin FBGA, Speed Grade 8, Commercial Grade, Pb-Free; Manufacturer: Altera; DatasheetVersion: ver1.6, Nov-2011; ComponentLink4URL: http://www.altera.com/devicepackaging/04R00247-02.pdf; ComponentLink2Description: Handbook; ComponentLink3Description: Pinout; ComponentLink2URL: http://www.altera.com/literature/hb/cyclone-iv/cyclone4-handbook.pdf; PackageReference: FBGA484_A-240; ComponentLink3URL: http://www.altera.com/literature/lit-dp.jsp?category=cyc%204&showspreadsheet=y; PackageDescription: 484-Pin FineLine Ball Grid Array (FBGA) - Wire Bond - A:2.40; PackageVersion: ver1.0, Jun-2011; ComponentLink1Description: Manufacturer URL; ComponentLink1URL: http://www.altera.com/; Code_JEDEC: MS-034-AAJ-1; ComponentLink4Description: Package Specification